# Altium schematic sheet CORE.SchDoc
size A3
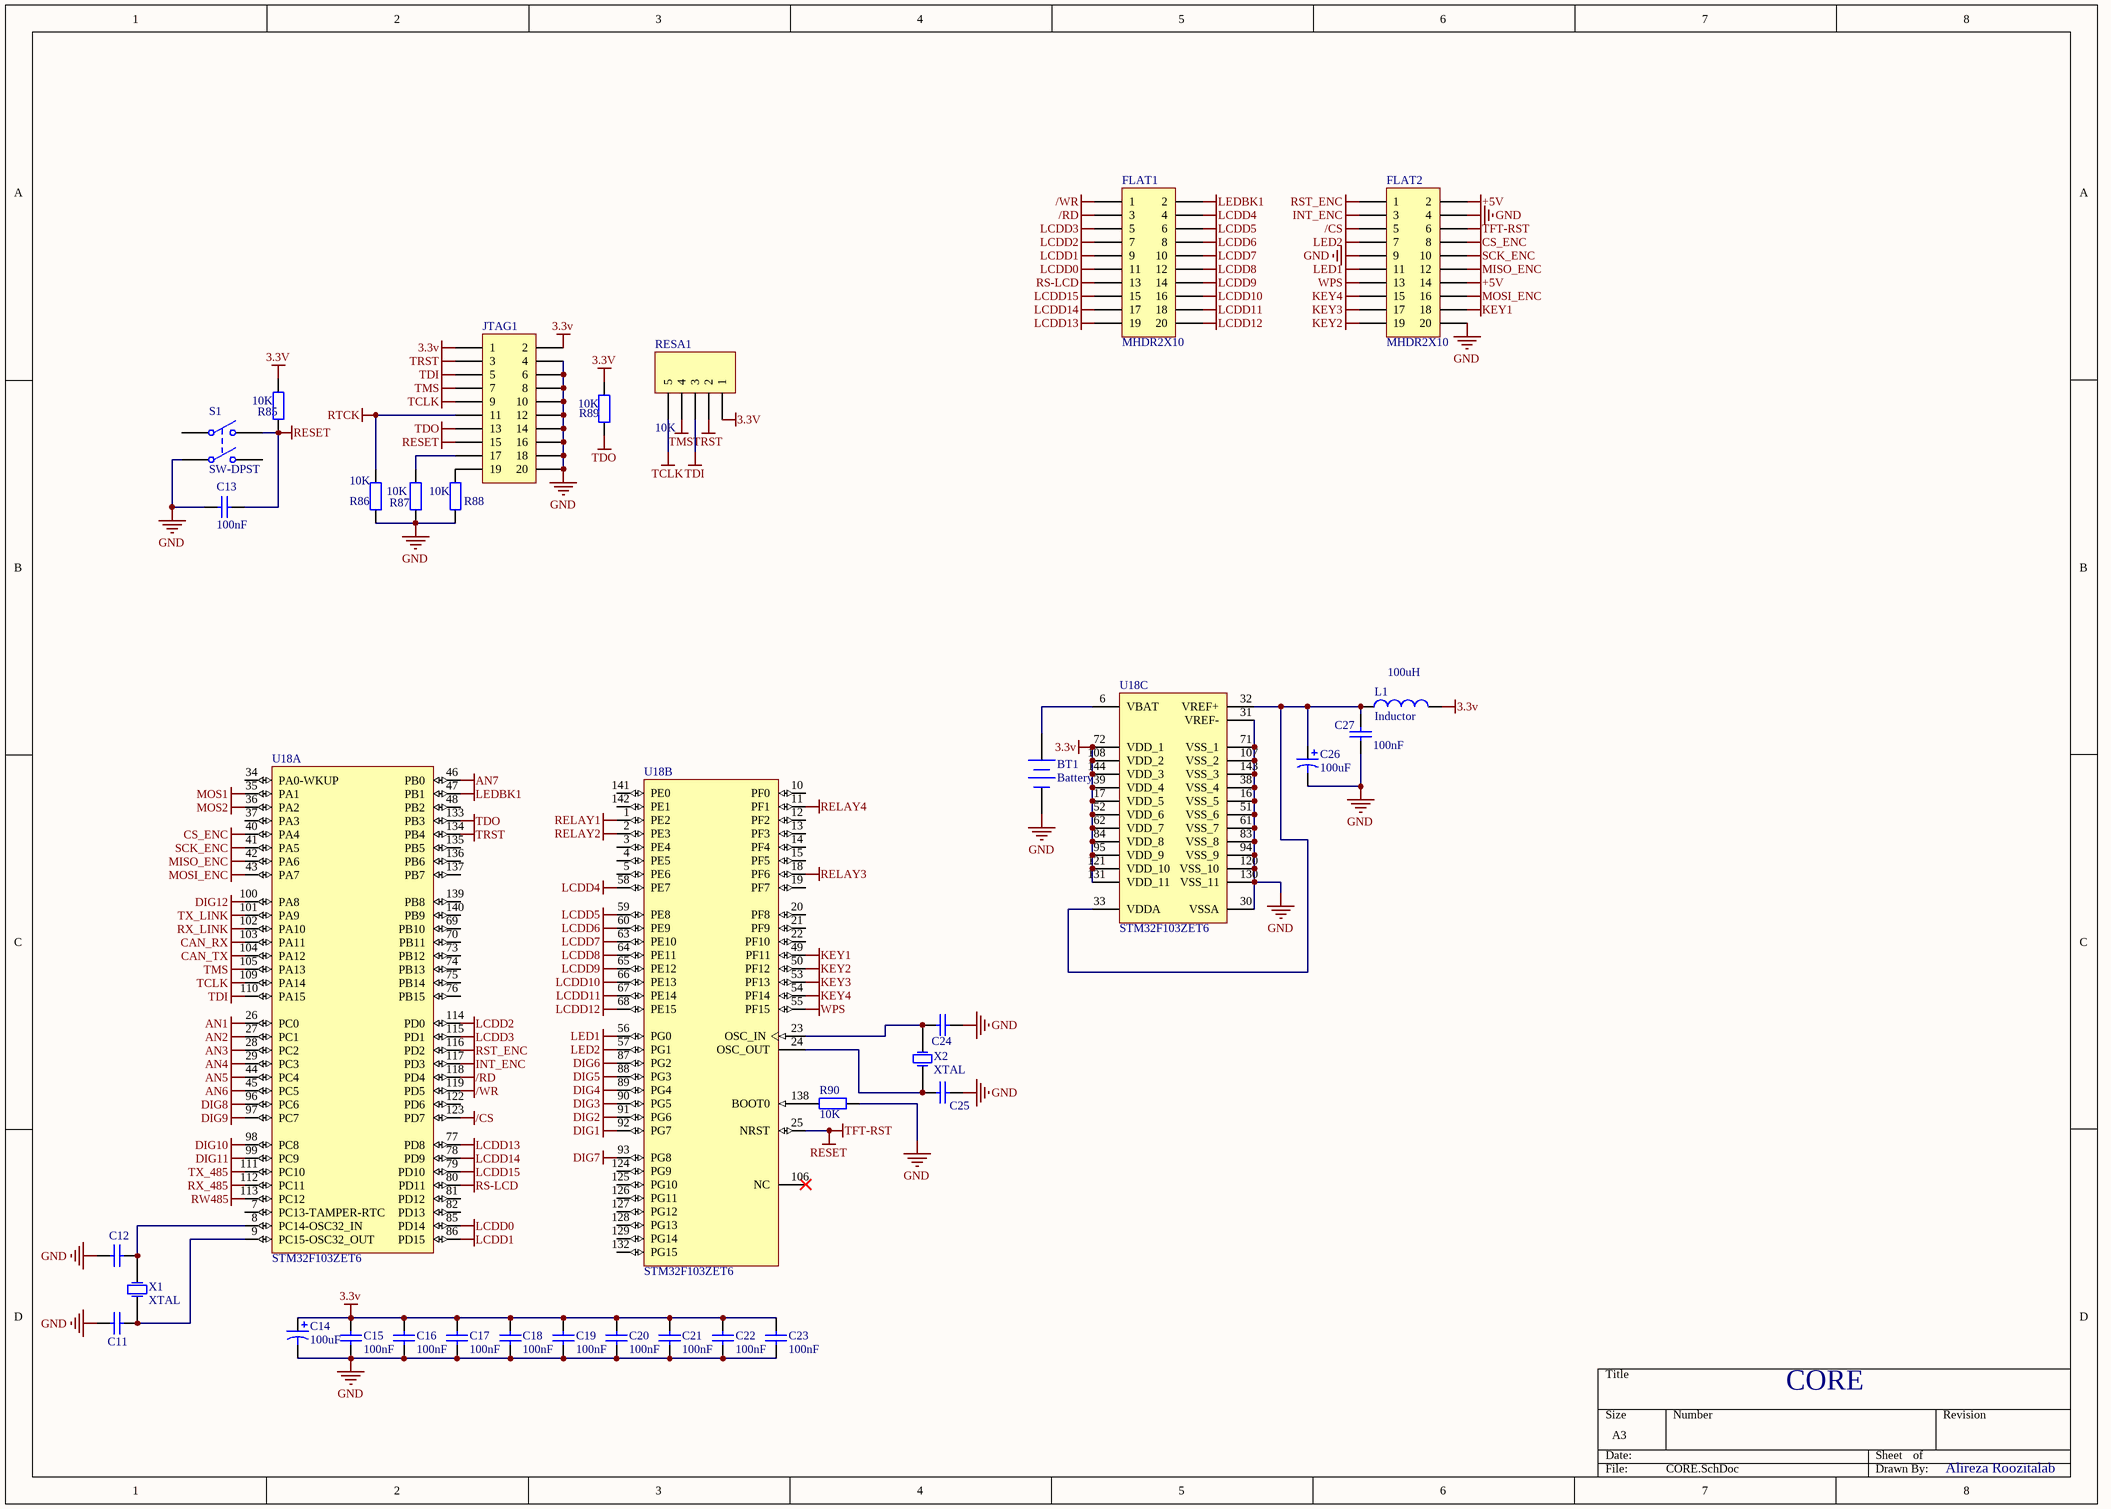
[diagram p0: CORE.SchDoc]

## Parts
BT1  Battery  [HDR1*2]
C11  Cap  [CAP 1206 (3216X08L)]  (value not drawn)
C12  Cap  [CAP 1206 (3216X08L)]  (value not drawn)
C13  value 100nF  [CAP 1206 (3216X08L)]  (hidden comment: Cap)
C14  value 100uF  [POL 100U16V]  (hidden comment: Cap Pol1)
C15  value 100nF  [CAP 1206 (3216X08L)]  (hidden comment: Cap)
C16  value 100nF  [CAP 1206 (3216X08L)]  (hidden comment: Cap)
C17  value 100nF  [CAP 1206 (3216X08L)]  (hidden comment: Cap)
C18  value 100nF  [CAP 1206 (3216X08L)]  (hidden comment: Cap)
C19  value 100nF  [CAP 1206 (3216X08L)]  (hidden comment: Cap)
C20  value 100nF  [CAP 1206 (3216X08L)]  (hidden comment: Cap)
C21  value 100nF  [CAP 1206 (3216X08L)]  (hidden comment: Cap)
C22  value 100nF  [CAP 1206 (3216X08L)]  (hidden comment: Cap)
C23  value 100nF  [CAP 1206 (3216X08L)]  (hidden comment: Cap)
C24  Cap  [CAP 1206 (3216X08L)]  (value not drawn)
C25  Cap  [CAP 1206 (3216X08L)]  (value not drawn)
C26  value 100uF  [POL 100U16V]  (hidden comment: Cap Pol1)
C27  value 100nF  [CAP 1206 (3216X08L)]  (hidden comment: Cap)
FLAT1  MHDR2X10  [box 20]
FLAT2  MHDR2X10  [box 20]
JTAG1  MHDR2X10  [box 20]  (value not drawn)
L1  Inductor  value 100uH  [TR]
R85  value 10K  [RES 1206 (3216X08L)]  (hidden comment: Res2)
R86  value 10K  [RES 1206 (3216X08L)]  (hidden comment: Res2)
R87  value 10K  [RES 1206 (3216X08L)]  (hidden comment: Res2)
R88  value 10K  [RES 1206 (3216X08L)]  (hidden comment: Res2)
R89  value 10K  [RES 1206 (3216X08L)]  (hidden comment: Res2)
R90  value 10K  [RES 1206 (3216X08L)]  (hidden comment: Res2)
RESA1  10K  [HEADER 5X1]
S1  SW-DPST  [SW4]
U18  STM32F103ZET6  [TQ144]  (parts A,B,C of 3)
X1  XTAL  [XTAL RTC]
X2  XTAL  [XTAL Small]

## Nets
3.3V: C14.1 C15.2 C16.2 C17.2 C18.2 C19.2 C20.2 C21.2 C22.2 C23.2 JTAG1.1 JTAG1.2 L1.2 R85.1 R89.1 RESA1.1 U18.17(VDD_5) U18.39(VDD_4) U18.52(VDD_6) U18.62(VDD_7) U18.72(VDD_1) U18.84(VDD_8) U18.95(VDD_9) U18.108(VDD_2) U18.121(VDD_10) U18.131(VDD_11) U18.144(VDD_3)
+5V: FLAT2.2 FLAT2.14
/CS: FLAT2.5 U18.123(PD7)
/RD: FLAT1.3 U18.118(PD4)
/WR: FLAT1.1 U18.119(PD5)
AN1: U18.26(PC0)
AN2: U18.27(PC1)
AN3: U18.28(PC2)
AN4: U18.29(PC3)
AN5: U18.44(PC4)
AN6: U18.45(PC5)
AN7: U18.46(PB0)
CAN_RX: U18.103(PA11)
CAN_TX: U18.104(PA12)
CS_ENC: FLAT2.8 U18.40(PA4)
DIG1: U18.92(PG7)
DIG2: U18.91(PG6)
DIG3: U18.90(PG5)
DIG4: U18.89(PG4)
DIG5: U18.88(PG3)
DIG6: U18.87(PG2)
DIG7: U18.93(PG8)
DIG8: U18.96(PC6)
DIG9: U18.97(PC7)
DIG10: U18.98(PC8)
DIG11: U18.99(PC9)
DIG12: U18.100(PA8)
GND: BT1.2(-) C11.2 C12.2 C13.2 C14.2 C15.1 C16.1 C17.1 C18.1 C19.1 C20.1 C21.1 C22.1 C23.1 C24.2 C25.2 C26.2 C27.1 FLAT2.4 FLAT2.9 FLAT2.20 JTAG1.4 JTAG1.6 JTAG1.8 JTAG1.10 JTAG1.12 JTAG1.14 JTAG1.16 JTAG1.18 JTAG1.20 R86.2 R87.2 R88.2 R90.2 S1.3(COMMON2) U18.16(VSS_5) U18.30(VSSA) U18.31(VREF-) U18.38(VSS_4) U18.51(VSS_6) U18.61(VSS_7) U18.71(VSS_1) U18.83(VSS_8) U18.94(VSS_9) U18.107(VSS_2) U18.120(VSS_10) U18.130(VSS_11) U18.143(VSS_3)
INT_ENC: FLAT2.3 U18.117(PD3)
KEY1: FLAT2.18 U18.49(PF11)
KEY2: FLAT2.19 U18.50(PF12)
KEY3: FLAT2.17 U18.53(PF13)
KEY4: FLAT2.15 U18.54(PF14)
LCDD0: FLAT1.11 U18.85(PD14)
LCDD1: FLAT1.9 U18.86(PD15)
LCDD2: FLAT1.7 U18.114(PD0)
LCDD3: FLAT1.5 U18.115(PD1)
LCDD4: FLAT1.4 U18.58(PE7)
LCDD5: FLAT1.6 U18.59(PE8)
LCDD6: FLAT1.8 U18.60(PE9)
LCDD7: FLAT1.10 U18.63(PE10)
LCDD8: FLAT1.12 U18.64(PE11)
LCDD9: FLAT1.14 U18.65(PE12)
LCDD10: FLAT1.16 U18.66(PE13)
LCDD11: FLAT1.18 U18.67(PE14)
LCDD12: FLAT1.20 U18.68(PE15)
LCDD13: FLAT1.19 U18.77(PD8)
LCDD14: FLAT1.17 U18.78(PD9)
LCDD15: FLAT1.15 U18.79(PD10)
LED1: FLAT2.11 U18.56(PG0)
LED2: FLAT2.7 U18.57(PG1)
LEDBK1: FLAT1.2 U18.47(PB1)
MISO_ENC: FLAT2.12 U18.42(PA6)
MOS1: U18.35(PA1)
MOS2: U18.36(PA2)
MOSI_ENC: FLAT2.16 U18.43(PA7)
RELAY1: U18.1(PE2)
RELAY2: U18.2(PE3)
RELAY3: U18.18(PF6)
RELAY4: U18.11(PF1)
RESET: C13.1 FLAT2.6 JTAG1.15 R85.2 S1.2(NO1) U18.25(NRST)  [also labelled TFT-RST]
RS-LCD: FLAT1.13 U18.80(PD11)
RST_ENC: FLAT2.1 U18.116(PD2)
RTCK: JTAG1.11 R86.1
RW485: U18.113(PC12)
RX_485: U18.112(PC11)
RX_LINK: U18.102(PA10)
SCK_ENC: FLAT2.10 U18.41(PA5)
TCLK: JTAG1.9 RESA1.5 U18.109(PA14)
TDI: JTAG1.5 RESA1.3 U18.110(PA15)
TDO: JTAG1.13 R89.2 U18.133(PB3)
TMS: JTAG1.7 RESA1.4 U18.105(PA13)
TRST: JTAG1.3 RESA1.2 U18.134(PB4)
TX_485: U18.111(PC10)
TX_LINK: U18.101(PA9)
WPS: FLAT2.13 U18.55(PF15)
NetBT1_1: BT1.1(+) U18.6(VBAT)
NetC11_1: C11.1 U18.9(PC15-OSC32_OUT) X1.2(OSC2)
NetC12_1: C12.1 U18.8(PC14-OSC32_IN) X1.1(OSC1)
NetC24_1: C24.1 U18.23(OSC_IN) X2.2(OSC2)
NetC25_1: C25.1 U18.24(OSC_OUT) X2.1(OSC1)
NetC26_1: C26.1 C27.2 L1.1 U18.32(VREF+) U18.33(VDDA)
NetJTAG1_17: JTAG1.17 R87.1
NetJTAG1_19: JTAG1.19 R88.1
NetR90_1: R90.1 U18.138(BOOT0)

Not connected (* = marked no-connect by the designer): S1 1(COMMON1) 4(NO2); U18 3(PE4) 4(PE5) 5(PE6) 7(PC13-TAMPER-RTC) 10(PF0) 12(PF2) 13(PF3) 14(PF4) 15(PF5) 19(PF7) 20(PF8) 21(PF9) 22(PF10) 34(PA0-WKUP) 37(PA3) 48(PB2) 69(PB10) 70(PB11) 73(PB12) 74(PB13) 75(PB14) 76(PB15) 81(PD12) 82(PD13) 106(NC)* 122(PD6) 124(PG9) 125(PG10) 126(PG11) 127(PG12) 128(PG13) 129(PG14) 132(PG15) 135(PB5) 136(PB6) 137(PB7) 139(PB8) 140(PB9) 141(PE0) 142(PE1)

## Notes on the sheet
- CORE
- Alireza Roozitalab

## Library data of the parts
BT1 = Battery: Multicell Battery; Published: 24-Mar-1999; LatestRevisionDate: 17-Jul-2002; LatestRevisionNote: Re-released for DXP Platform.; PackageReference: BAT-2; Publisher: Altium Limited
C11 C12 C24 C25 = Cap: Capacitor; Value: 100nF; Published: 8-Jun-2000; LatestRevisionDate: 17-Jul-2002; LatestRevisionNote: Re-released for DXP Platform.; PackageReference: RAD-0.3; Publisher: Altium Limited
C13 C15-C23 C27 = Cap: Capacitor; Published: 8-Jun-2000; LatestRevisionDate: 17-Jul-2002; LatestRevisionNote: Re-released for DXP Platform.; PackageReference: RAD-0.3; Publisher: Altium Limited
C14 C26 = Cap Pol1: Polarized Capacitor (Radial); Published: 8-Jun-2000; LatestRevisionDate: 17-Jul-2002; LatestRevisionNote: Re-released for DXP Platform.; PackageReference: RB7.6-15; Publisher: Altium Limited
FLAT1 FLAT2 JTAG1 = MHDR2X10: Header, 10-Pin, Dual row; LatestRevisionDate: 17-Jul-2002; LatestRevisionNote: Re-released for DXP Platform.; Publisher: Altium Limited
L1 = Inductor: Code_IEC: 1005; Published: 8-Jun-2000; LatestRevisionDate: 17-Jul-2002; LatestRevisionNote: Re-released for DXP Platform.; PackageReference: 0402-A; Publisher: Altium Limited; Code_JEITA: 0402
R85-R90 = Res2: Resistor; Published: 8-Jun-2000; LatestRevisionDate: 17-Jul-2002; LatestRevisionNote: Re-released for DXP Platform.; PackageReference: AXIAL-0.4; Publisher: Altium Limited
RESA1 = MHDR1X5: Header, 5-Pin; LatestRevisionDate: 17-Jul-2002; LatestRevisionNote: Re-released for DXP Platform.; Publisher: Altium Limited
S1 = SW-DPST: Double-Pole, Single-Throw Switch; Published: 24-Mar-1999; LatestRevisionDate: 17-Jul-2002; LatestRevisionNote: Re-released for DXP Platform.; PackageReference: DPST-4; Publisher: Altium Limited
U18 = STM32F103ZET6: ARM Cortex-M3 32-bit MCU, 512 KB Flash, 64 KB Internal RAM, 112 I/Os, 144-pin LQFP, -40 to 85 degC, Tray; A/D Converter: 3x12-bit (21 Channel); D/A Converter: 2x12-bit (2 Channel); FLASH Size (Prog) (kB): 512; I/Os (High Current): 112; Internal RAM Size (kB): 64; Operating Frequency(F) (Processor speed) (MHz): 72; Supply Voltage(Vcc) min (V): 2; DatasheetVersion: Rev. 8; PackageVersion: Rev. 4, 06/2013; PackageReference: LQFP144; PackageDescription: 144-Pin Low Profile Quad Flat Package, 20 x 20 mm Body, 0.5 mm Pitch; Supplier 1: Digi-Key; Supplier Part Number 1: 497-6442-ND; Supplier 2: Farnell; Supplier Part Number 2: 1624145; Supplier 3: Newark; Supplier Part Number 3: 57P1270; Supplier 4: Mouser; Supplier Part Number 4: 511-STM32F103ZET6; Core: ARM Cortex-M3; Packing: Tray; Mounting Technology: Surface Mount; PartNumber: STM32F103ZET6; ComponentLink1Description: Manufacturer URL; ComponentLink1URL: http://www.st.com/web/en/home.html; ComponentLink2Description: Datasheet; ComponentLink2URL: http://www.st.com/st-web-ui/static/active/en/resource/technical/document/datasheet/CD00191185.pdf; ComponentLink3Description: Package Specification; ComponentLink3URL: http://www.st.com/st-web-ui/static/active/en/resource/technical/document/datasheet/DM00037051.pdf
X1 X2 = XTAL: Crystal Oscillator; Published: 8-Jun-2000; LatestRevisionDate: 17-Jul-2002; LatestRevisionNote: Re-released for DXP Platform.; PackageReference: R38; Publisher: Altium Limited